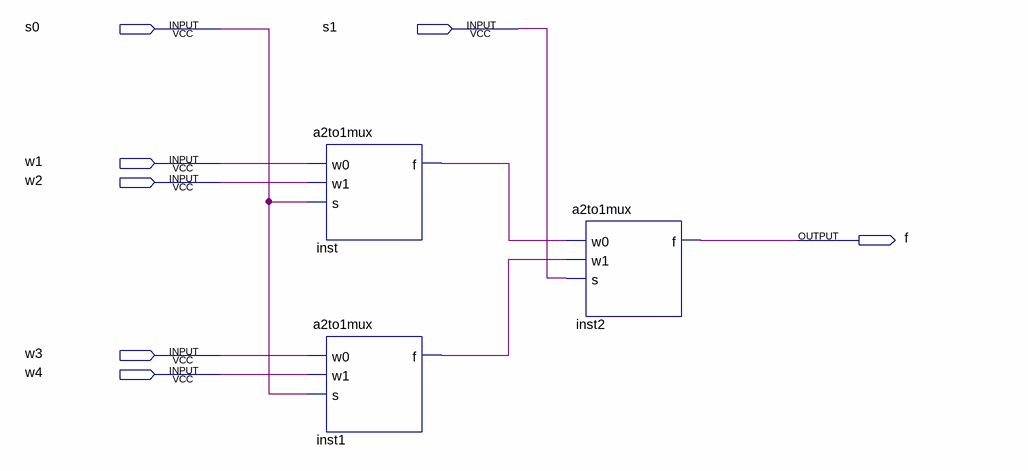
[diagram p0: schematic sheet]
// Quartus schematic muxModified.bdf as structural Verilog: 3 symbols, 7 pins
module muxModified (
  input  s0,
  input  s1,
  input  w1,
  input  w2,
  input  w3,
  input  w4,
  output f
);

  wire inst1_f, inst_f;

  a2to1mux inst (.w0(w1), .w1(w2), .s(s0), .f(inst_f));
  a2to1mux inst1 (.w0(w3), .w1(w4), .s(s0), .f(inst1_f));
  a2to1mux inst2 (.w0(inst_f), .w1(inst1_f), .s(s1), .f(f));
endmodule
